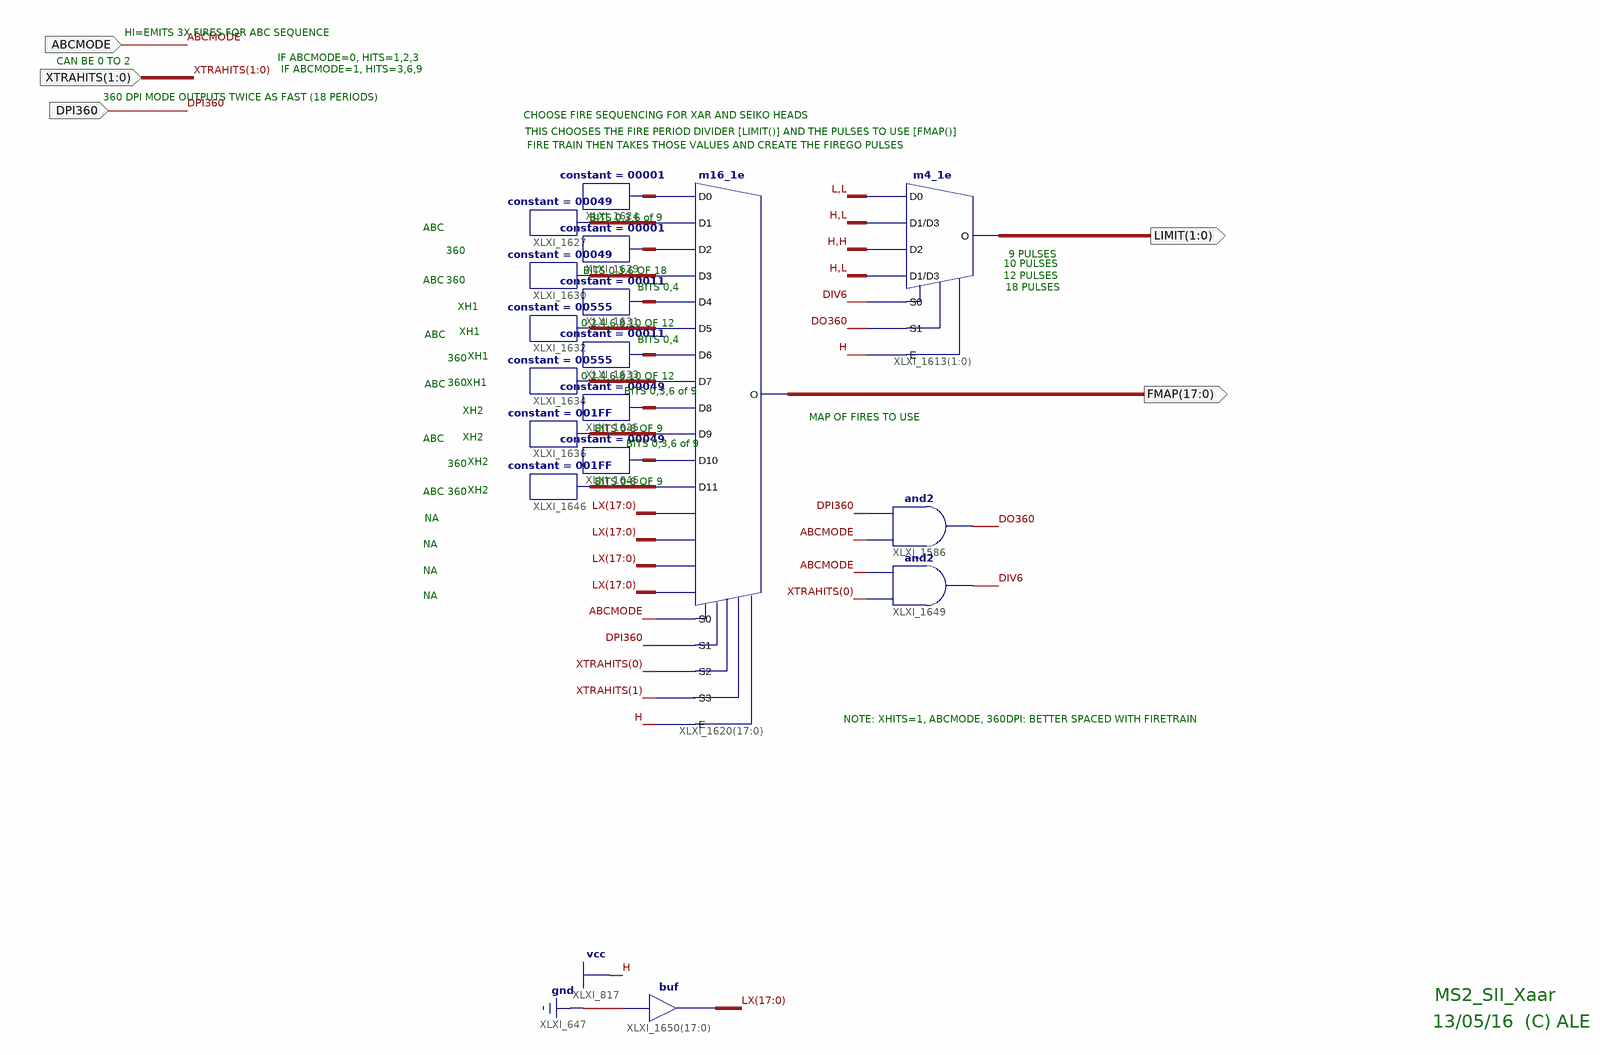
[diagram p0: schematic sheet 1]
// Xilinx ISE schematic DB_MS2_SII_Xaar_Map.sch (spartan3e) as structural Verilog: 17 symbols, 5 ports
module DB_MS2_SII_Xaar_Map (
  input  ABCMODE,
  input  DPI360,
  input  [1:0] XTRAHITS,
  output [1:0] LIMIT,
  output [17:0] FMAP
);

  wire DIV6, DO360;
  wire [17:0] LX, XLXN_1935, XLXN_1959, XLXN_1970, XLXN_1971, XLXN_1972, XLXN_1973, XLXN_1974, XLXN_1975,
       XLXN_1976, XLXN_1977, XLXN_2002, XLXN_2003;

  m16_1e XLXI_1620[17:0] (
    .D0(XLXN_1935), .D1(XLXN_1959), .D10(XLXN_2002), .D11(XLXN_2003), .D12(LX), .D13(LX), .D14(LX), .D15(LX),
    .D2(XLXN_1970), .D3(XLXN_1971), .D4(XLXN_1972), .D5(XLXN_1973), .D6(XLXN_1974), .D7(XLXN_1975),
    .D8(XLXN_1976), .D9(XLXN_1977), .E(1'b1), .S0(ABCMODE), .S1(DPI360), .S2(XTRAHITS[0]), .S3(XTRAHITS[1]),
    .O(FMAP));
  constant #(.CValue("00001")) XLXI_1624 (.O(XLXN_1935));
  constant #(.CValue("00049")) XLXI_1627 (.O(XLXN_1959));
  constant #(.CValue("00001")) XLXI_1629 (.O(XLXN_1970));
  constant #(.CValue("00049")) XLXI_1630 (.O(XLXN_1971));
  constant #(.CValue("00011")) XLXI_1631 (.O(XLXN_1972));
  constant #(.CValue("00555")) XLXI_1632 (.O(XLXN_1973));
  constant #(.CValue("00011")) XLXI_1633 (.O(XLXN_1974));
  constant #(.CValue("00555")) XLXI_1634 (.O(XLXN_1975));
  constant #(.CValue("00049")) XLXI_1635 (.O(XLXN_1976));
  constant #(.CValue("001FF")) XLXI_1636 (.O(XLXN_1977));
  constant #(.CValue("00049")) XLXI_1645 (.O(XLXN_2002));
  constant #(.CValue("001FF")) XLXI_1646 (.O(XLXN_2003));
  m4_1e XLXI_1613[1:0] (.D0(2'b00), .D1(2'b10), .D2(2'b11), .D3(2'b10), .E(1'b1), .S0(DIV6), .S1(DO360), .O(LIMIT));
  and XLXI_1586 (DO360, ABCMODE, DPI360);
  and XLXI_1649 (DIV6, XTRAHITS[0], ABCMODE);
  assign LX = {18{1'b0}};  // buf XLXI_1650[17..0], 18 bits wide

  // Notes on the sheet:
  //   HI=EMITS 3X FIRES FOR ABC SEQUENCE
  //   IF ABCMODE=0, HITS=1,2,3
  //   CAN BE 0 TO 2
  //   IF ABCMODE=1, HITS=3,6,9
  //   360 DPI MODE OUTPUTS TWICE AS FAST (18 PERIODS)
  //   CHOOSE FIRE SEQUENCING FOR XAR AND SEIKO HEADS
  //   THIS CHOOSES THE FIRE PERIOD DIVIDER [LIMIT()] AND THE PULSES TO USE [FMAP()]
  //   FIRE TRAIN THEN TAKES THOSE VALUES AND CREATE THE FIREGO PULSES
  //   BITS 0,3,6 of 9
  //   ABC
  //   360
  //   9 PULSES
  //   10 PULSES
  //   BITS 0,3,6 OF 18
  //   12 PULSES
  //   ABC
  //   360
  //   BITS 0,4
  //   18 PULSES
  //   XH1
  //   0,2,4,6,8,10 OF 12
  //   XH1
  //   ABC
  //   BITS 0,4
  //   XH1
  //   360
  //   0,2,4,6,8,10 OF 12
  //   360
  //   XH1
  //   ABC
  //   BITS 0,3,6 of 9
  //   XH2
  //   MAP OF FIRES TO USE
  //   BITS 0-8 OF 9
  //   XH2
  //   ABC
  //   BITS 0,3,6 of 9
  //   XH2
  //   360
  //   BITS 0-8 OF 9
  //   XH2
  //   ABC
  //   360
  //   NA
  //   NA
  //   NA
  //   NA
  //   NOTE: XHITS=1, ABCMODE, 360DPI: BETTER SPACED WITH FIRETRAIN
  //   MS2_SII_Xaar
  //   13/05/16  (C) ALE
endmodule
